# EAGLE design untitled (EAGLE 9.6.2)
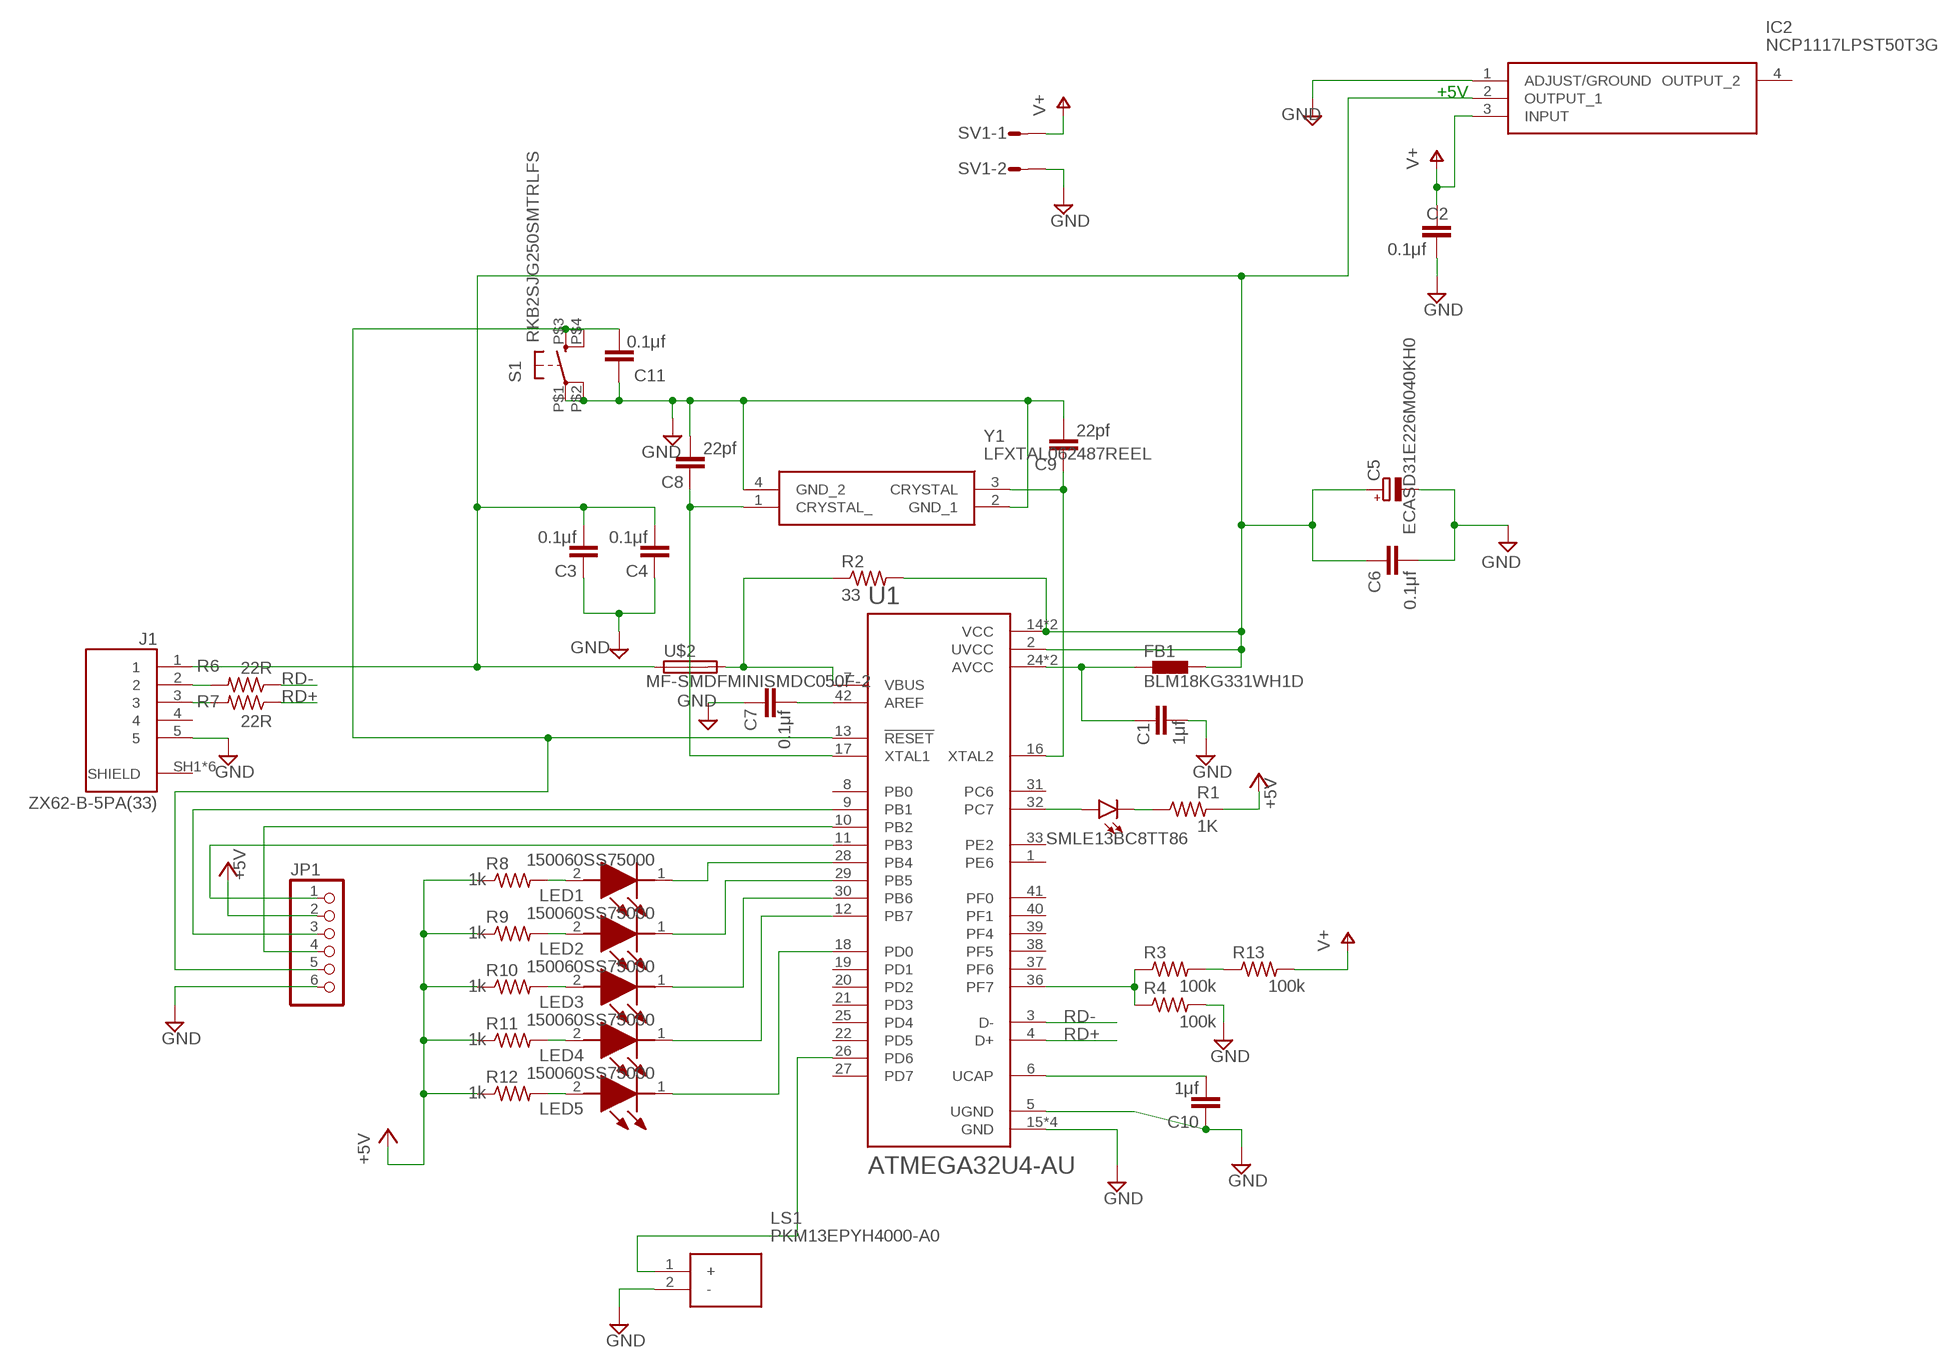
[diagram p0: schematic, sheet 1]

## Parts
C1  1μf  C-EUC0603  [C0603]
C2  0.1μf  C-EUC0603  [C0603]
C3  0.1μf  C-EUC0603  [C0603]
C4  0.1μf  C-EUC0603  [C0603]
C5  ECASD31E226M040KH0  [ECASD31E226M040KH0]
C6  0.1μf  C-EUC0603  [C0603]
C7  0.1μf  C-EUC0603  [C0603]
C8  22pf  C-EUC0603  [C0603]
C9  22pf  C-EUC0603  [C0603]
C10  1μf  C-EUC0603  [C0603]
C11  0.1μf  C-EUC0603  [C0603]
FB1  BLM18KG331WH1D  [BEADC1608X75N]
IC2  NCP1117LPST50T3G  [SOT230P700X180-4N]
J1  ZX62-B-5PA(33)  [HRS_ZX62-B-5PA(33)]
JP1  PINHD-1X6  [1X06]
LD1  LEDCHIPLED_0603  [CHIPLED_0603]
LED1  150060SS75000  [LEDC1608X80N]
LED2  150060SS75000  [LEDC1608X80N]
LED3  150060SS75000  [LEDC1608X80N]
LED4  150060SS75000  [LEDC1608X80N]
LED5  150060SS75000  [LEDC1608X80N]
LS1  PKM13EPYH4000-A0  [PKM13EPYH4002-B0]
R1  1K  R-US_R0603  [R0603]
R2  33  R-US_R0603  [R0603]
R3  100k  R-US_R0603  [R0603]
R4  100k  R-US_R0603  [R0603]
R6  22R  R-US_R0603  [R0603]
R7  22R  R-US_R0603  [R0603]
R8  1k  R-US_R0603  [R0603]
R9  1k  R-US_R0603  [R0603]
R10  1k  R-US_R0603  [R0603]
R11  1k  R-US_R0603  [R0603]
R12  1k  R-US_R0603  [R0603]
R13  100k  R-US_R0603  [R0603]
S1  RKB2SJG250SMTRLFS  [RKB2SJG250SMTRLFS]
SV1  L02P  [L02P]
U1  ATMEGA32U4-AU  [QFP80P1200X1200X120-44N]
U$2  MF-SMDFMINISMDC050F-2  [MINISMDC050F-2]
Y1  LFXTAL062487REEL  [LFXTAL062487REEL]

## Nets
+5V [PWR]: JP1.2 R1.2 R8.1 R9.1 R10.1 R11.1 R12.1
GND [New Class]: C1.2 C2.2 C3.1 C4.1 C5.P$2(-) C6.1 C7.1 C8.2 C9.2 C10.1 C11.1 IC2.1(ADJUST/GROUND) J1.5 JP1.6 LS1.2(-) R4.2 S1.P$1(P) S1.P$2(P1) SV1.2 U1.5(UGND) U1.15(GND) U1.23(GND) U1.35(GND) U1.43(GND) Y1.2(GND_1) Y1.4(GND_2)
N$1 [New Class]: C7.2 U1.42(AREF)
N$2 [New Class]: C10.2 U1.6(UCAP)
N$3 [New Class]: C1.1 FB1.1 U1.24(AVCC) U1.44(AVCC)
N$4 [New Class]: LD1.A U1.32(PC7)
N$5 [New Class]: C8.1 U1.17(XTAL1) Y1.1(CRYSTAL_)
N$6 [New Class]: C9.1 U1.16(XTAL2) Y1.3(CRYSTAL)
N$7 [New Class]: LED5.1(K) U1.18(PD0)
N$8 [New Class]: C3.2 C4.2 C5.P$1(+) C6.2 FB1.2 IC2.2(OUTPUT_1) J1.1 R2.2 U1.2(UVCC) U1.14(VCC) U1.34(VCC) U$2.P$1
N$9 [New Class]: J1.2 R6.2
N$10 [New Class]: J1.3 R7.2
N$11 [New Class]: LD1.C R1.1
N$12 [New Class]: R3.1 R4.1 U1.36(PF7)
N$13: R3.2 R13.1
N$15 [New Class]: R2.1 U1.7(VBUS) U$2.P$2
N$16 [New Class]: JP1.1 U1.11(PB3)
N$17 [New Class]: JP1.3 U1.9(PB1)
N$18 [New Class]: JP1.4 U1.10(PB2)
N$19 [New Class]: LED4.1(K) U1.12(PB7)
N$20 [New Class]: LED3.1(K) U1.30(PB6)
N$21 [New Class]: C11.2 JP1.5 S1.P$3(S) S1.P$4(S1) U1.13(!RESET)
N$22 [New Class]: LED2.1(K) U1.29(PB5)
N$23 [New Class]: LED1.1(K) U1.28(PB4)
N$24 [New Class]: LED1.2(A) R8.2
N$30 [New Class]: LED2.2(A) R9.2
N$31 [New Class]: LED3.2(A) R10.2
N$32 [New Class]: LED4.2(A) R11.2
N$33 [New Class]: LED5.2(A) R12.2
N$40 [New Class]: LS1.1(+) U1.26(PD6)
RD+ [New Class]: R7.1 U1.4(D+)
RD- [New Class]: R6.1 U1.3(D-)
V+ [PWR]: C2.1 IC2.3(INPUT) R13.2 SV1.1
Unconnected: IC2.4(OUTPUT_2) J1.4 J1.SH1(SHIELD) J1.SH2(SHIELD) J1.SH3(SHIELD) J1.SH4(SHIELD) J1.SH5(SHIELD) J1.SH6(SHIELD) U1.1(PE6) U1.8(PB0) U1.19(PD1) U1.20(PD2) U1.21(PD3) U1.22(PD5) U1.25(PD4) U1.27(PD7) U1.31(PC6) U1.33(PE2) U1.37(PF6) U1.38(PF5) U1.39(PF4) U1.40(PF1) U1.41(PF0)

## Notes on the sheet
- +5V
- SMLE13BC8TT86

## Library data of the parts
C1-C4 C6-C11 = rcl:C-EU: CAPACITOR, European symbol; SPICEPREFIX: C
C5 = ECASD31E226M040KH02:ECASD31E226M040KH0
FB1 = BEADC1608X75N:BLM18KG331WH1D: 100 Ohms @ 100MHz 1 Power Line Ferrite Bead 0603 (1608 Metric) 1.5A 55mOhm Check prices <https://pricing.snapeda.com/parts/BLM18KG331WH1D/Murata/view-part?ref=eda>; AVAILABILITY: In Stock; DESCRIPTION: 330 Ohms @ 100MHz 1 Power Line Ferrite Bead 0603 (1608 Metric) 1.25A 110mOhm; MF: Murata; MP: BLM18KG331WH1D; PACKAGE: 0603 Murata; PRICE: None; PURCHASE-URL: https://pricing.snapeda.com/search/part/BLM18KG331WH1D/?ref=eda
IC2 = SamacSys_Parts:NCP1117LPST50T3G: ON SEMICONDUCTOR - NCP1117LPST50T3G - LDO Voltage Regulator, Fixed, AEC-Q100, 18V input, 1.3 V drop., 1A out, SOT-223-3 Source: Datasheet <http://www.onsemi.com/pub/Collateral/NCP1117LP-D.PDF>; DESCRIPTION: ON SEMICONDUCTOR - NCP1117LPST50T3G - LDO Voltage Regulator, Fixed, AEC-Q100, 18V input, 1.3 V drop., 1A out, SOT-223-3; HEIGHT: 1.8mm; MANUFACTURER_NAME: ON Semiconductor; MANUFACTURER_PART_NUMBER: NCP1117LPST50T3G; MOUSER_PART_NUMBER: 863-NCP1117LPST50T3G; MOUSER_PRICE-STOCK: https://www.mouser.co.uk/ProductDetail/onsemi/NCP1117LPST50T3G?qs=kbSN2QblFfKscBRGjva23w%3D%3D
J1 = ZX62-B-5PA_33_:ZX62-B-5PA(33): ZX Series 5 Position Right Angle PCB Wire Micro B USB Plug Check prices <https://pricing.snapeda.com/parts/ZX62-B-5PA%2833%29/Hirose/view-part?ref=eda>; AVAILABILITY: In Stock; DESCRIPTION: USB - micro B USB 2.0 Receptacle Connector 5 Position Surface Mount, Right Angle; MF: Hirose; MP: ZX62-B-5PA(33); PACKAGE: None; PRICE: None; PURCHASE-URL: https://pricing.snapeda.com/search/part/ZX62-B-5PA(33)/?ref=eda
JP1 = pinhead:PINHD-1X6: PIN HEADER
LD1 = led:LED: LED OSRAM: - CHIPLED LG R971, LG N971, LY N971, LG Q971, LY Q971, LO R971, LY R971 LH N974, LH R974 LS Q976, LO Q976, LY Q976 LO Q996 - Hyper CHIPLED LW Q18S LB Q993, LB Q99A, LB R99A - SideLED LS A670, LO A670, LY A670, LG A670, LP A670 LB A673, LV A673, LT A673, LW A673 LH A674 LY A675 LS A676, LA A676, LO A676, LY A676, LW A676 LS A679, LY A679, LG A679 - Hyper Micro SIDELED® LS Y876, LA Y876, LO Y876, LY Y876 LT Y87S - SmartLED LW L88C, LW L88S LB L89C, LB L89S, LG L890 LS L89K, LO L89K, LY L89K LS L896, LA L896, LO L896, LY L896 - TOPLED LS T670, LO T670, LY T670, LG T670, LP T670 LSG T670, LSP T670, LSY T670, LOP T670, LYG T670 LG T671, LOG T671, LSG T671 LB T673, LV T673, LT T673, LW T673 LH T674 LS T676, LA T676, LO T676, LY T676, LB T676, LH T676, LSB T676, LW T676 LB T67C, LV T67C, LT T67C, LS T67K, LO T67K, LY T67K, LW E67C LS E67B, LA E67B, LO E67B, LY E67B, LB E67C, LV E67C, LT E67C LW T67C LS T679, LY T679, LG T679 LS T770, LO T770, LY T770, LG T770, LP T770 LB T773, LV T773, LT T773, LW T773 LH T774 LS E675, LA E675, LY E675, LS T675 LS T776, LA T776, LO T776, LY T776, LB T776 LHGB T686 LT T68C, LB T68C - Hyper Mini TOPLED® LB M676 - Mini TOPLED Santana® LG M470 LS M47K, LO M47K, LY M47K Source: http://www.osram.convergy.de LUXEON: - LUMILED® LXK2-PW12-R00, LXK2-PW12-S00, LXK2-PW14-U00, LXK2-PW14-V00 LXK2-PM12-R00, LXK2-PM12-S00, LXK2-PM14-U00 LXK2-PE12-Q00, LXK2-PE12-R00, LXK2-PE12-S00, LXK2-PE14-T00, LXK2-PE14-U00 LXK2-PB12-K00, LXK2-PB12-L00, LXK2-PB12-M00, LXK2-PB14-N00, LXK2-PB14-P00, LXK2-PB14-Q00 LXK2-PR12-L00, LXK2-PR12-M00, LXK2-PR14-Q00, LXK2-PR14-R00 LXK2-PD12-Q00, LXK2-PD12-R00, LXK2-PD12-S00 LXK2-PH12-R00, LXK2-PH12-S00 LXK2-PL12-P00, LXK2-PL12-Q00, LXK2-PL12-R00 Source: www.luxeon.com KINGBRIGHT: KA-3528ASYC Source: www.kingbright.com
LED1-LED5 = SamacSys_Parts:150060SS75000: LED,Wurth Elektronik,150060SS75000 Wurth Elektronik 150060SS75000, WL-SMCW Series Red LED, 630 nm, 1608 (0603) Clear, Rectangle Lens SMD Package Source: Datasheet; DESCRIPTION: LED,Wurth Elektronik,150060SS75000 Wurth Elektronik 150060SS75000, WL-SMCW Series Red LED, 630 nm, 1608 (0603) Clear, Rectangle Lens SMD Package; HEIGHT: 0.8mm; MANUFACTURER_NAME: Wurth Elektronik; MANUFACTURER_PART_NUMBER: 150060SS75000; MOUSER_PART_NUMBER: 710-150060SS75000; MOUSER_PRICE-STOCK: https://www.mouser.co.uk/ProductDetail/Wurth-Elektronik/150060SS75000?qs=LlUlMxKIyB0oQaxwspeTEA%3D%3D
LS1 = SamacSys_Parts:PKM13EPYH4000-A0: Transducer piezo PCB 30Vpp 70dB Murata 70dB Through Hole Continuous External Piezo Buzzer Source: Datasheet <http://www.murata.com/en-eu/api/pdfdownloadapi?cate=&partno=PKM13EPYH4000-A0>; DESCRIPTION: Transducer piezo PCB 30Vpp 70dB Murata 70dB Through Hole Continuous External Piezo Buzzer; HEIGHT: mm; MANUFACTURER_NAME: Murata Electronics; MANUFACTURER_PART_NUMBER: PKM13EPYH4000-A0; MOUSER_PART_NUMBER: 81-PKM13EPYH4000-A0; MOUSER_PRICE-STOCK: https://www.mouser.co.uk/ProductDetail/Murata-Electronics/PKM13EPYH4000-A0?qs=flZjIlU0hx3F33gxKU9zcw%3D%3D
R1-R4 R6-R13 = rcl:R-US_: RESISTOR, American symbol; SPICEPREFIX: R
S1 = RKB2SJG250SMTR LFS:RKB2SJG250SMTRLFS
SV1 = con-amp-mt:L02P: AMP MT CONNECTOR; OC_FARNELL: unknown; OC_NEWARK: unknown
U1 = ATMEGA32U4-AU:ATMEGA32U4-AU: ATmega Series 16 MHz 32 KB Flash 2.5 KB SRAM 8-Bit Microcontroller - TQFP-44 Check prices <https://pricing.snapeda.com/parts/ATMEGA32U4-AU/Microchip%20Technology/view-part?ref=eda>; AVAILABILITY: In Stock; DESCRIPTION: AVR AVR® ATmega Microcontroller IC 8-Bit 16MHz 32KB (16K x 16) FLASH 44-TQFP (10x10); MF: Microchip Technology; MP: ATMEGA32U4-AU; PACKAGE: TQFP-44 Microchip Technology / Atmel; PRICE: None; PURCHASE-URL: https://pricing.snapeda.com/search/part/ATMEGA32U4-AU/?ref=eda
U$2 = MINISMDC050F-2:MF-SMDF: MF-SMDF Series - PRC Resettable Fuses Source: http://www.farnell.com/datasheets/716597.pdf
Y1 = SamacSys_Parts:LFXTAL062487REEL: Crystals 16MHz 22pF -10C 60C Source: Datasheet <https://www.iqdfrequencyproducts.com/products/pn/LFXTAL062487Reel.pdf>; DESCRIPTION: Crystals 16MHz 22pF -10C 60C; HEIGHT: 0.6mm; MANUFACTURER_NAME: IQD; MANUFACTURER_PART_NUMBER: LFXTAL062487Reel; MOUSER_PART_NUMBER: 449-LFXTAL062487REEL; MOUSER_PRICE-STOCK: https://www.mouser.co.uk/ProductDetail/IQD/LFXTAL062487Reel?qs=e4%2FAndAAwgKTrG0QMc3CnQ%3D%3D

## Net classes
1 New Class: width 0.25 mm
2 PWR: width 1 mm

## Board
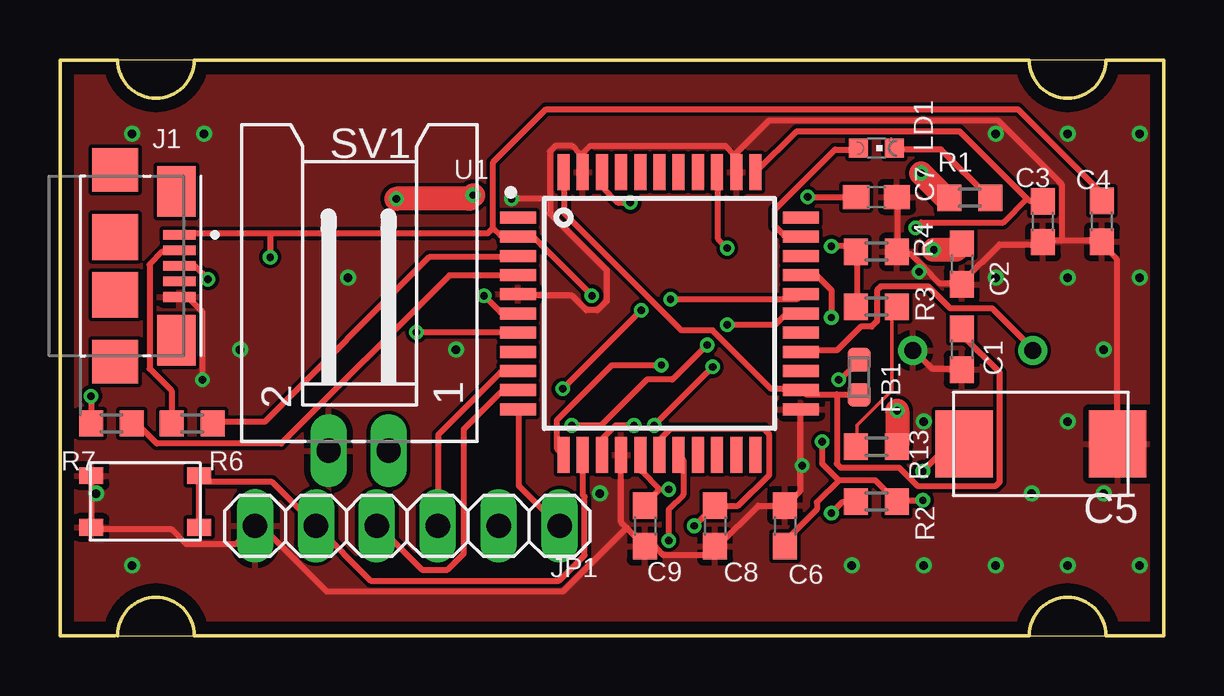
[diagram p1: board, top side]
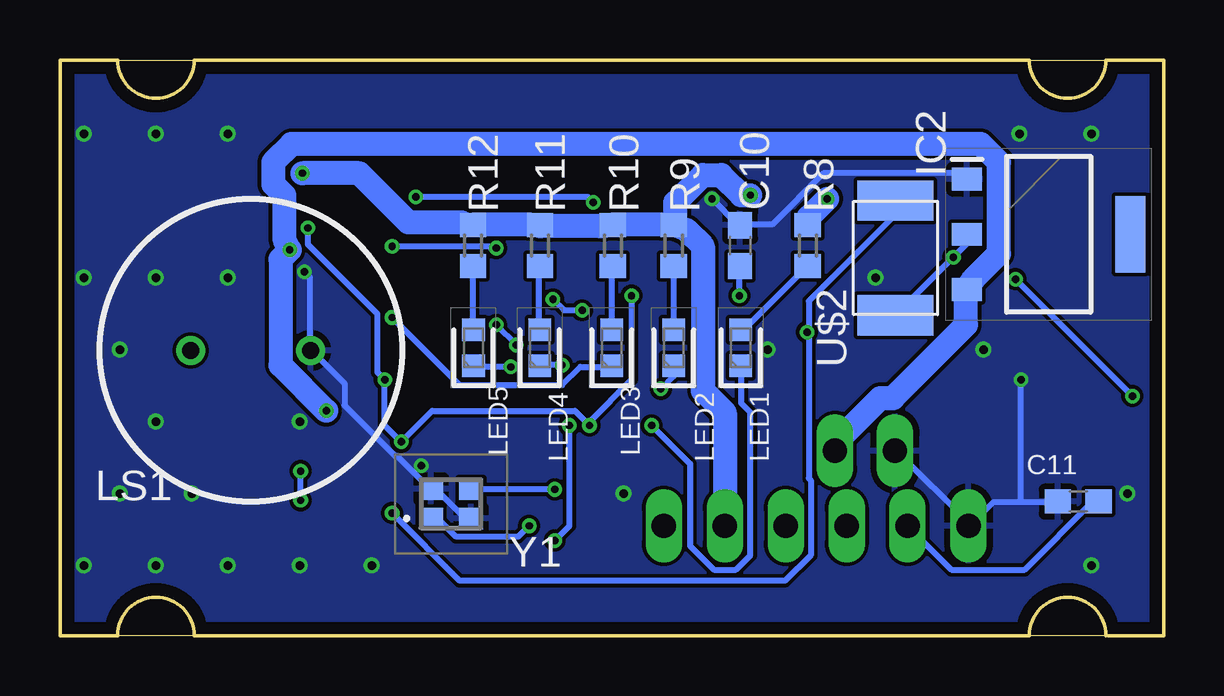
[diagram p2: board, bottom side, seen from below]

Size 46 x 24 mm. Coordinates in mm from the lower left corner, seen from the top.
Outline: 2.4,0 2.3,0 0,0 0,24 2.4,24
Outline: 2.4,0 5.6,0
Outline: 40.4,0 43.6,0
Outline: 43.6,24 40.4,24
Outline: 5.6,24 2.4,24
Outline: 2.4,0 arc-180 5.6,0
Outline: 40.4,0 arc-180 43.6,0
Outline: 43.6,24 arc-180 40.4,24
Outline: 5.6,24 arc-180 2.4,24
Outline: 5.6,24 40.4,24
Outline: 43.6,24 46,24 46,0 43.6,0
Outline: 40.4,0 5.6,0
Copper layers (1*16): Top 0.035mm / dielectric 1.6mm / Bottom 0.035mm
Design rules "Elecrow_2-layer_PCB_eagle_rule": minimum track width 6mil, minimum drill 12mil, track to track 6mil, track to pad 6mil, pad to pad 6mil, via to via 8mil, smd to smd 0mil, copper to edge 20mil, drill to drill 10mil, minimum pad ring 6mil, minimum via ring 6mil, stop-mask expansion 0mil, vias tented up to drill 100mil, thermal gap 10mil

### Footprints (pad centres in the part's own frame; a part is rotated, then mirrored left to right if it is on the bottom)
C0603 = smd 1.1 x 1: 1 -0.85,0; 2 0.85,0
ECASD31E226M040KH0 = smd 2.4 x 2.8: P$1 -3.2,0; P$2 3.2,0
BEADC1608X75N = smd 1 x 0.97: 1 -0.735,0; 2 0.735,0
SOT230P700X180-4N = smd 1.25 x 0.95: 1 -3.4,2.3; 2 -3.4,0; 3 -3.4,-2.3 | smd 1.25 x 3.2: 4 3.4,0
HRS_ZX62-B-5PA(33) = smd 0.4 x 1.35: 1 -1.3,2.675; 2 -0.65,2.675; 3 0,2.675; 4 0.65,2.675; 5 1.3,2.675 | smd 2.1 x 1.6: SH1 -3.1,2.55; SH6 3.1,2.55 | smd 1.8 x 1.9: SH2 -4,0; SH5 4,0 | smd 1.9 x 1.9: SH3 -1.2,0; SH4 1.2,0
1X06 = drill 1.016 long: 1 -6.35,0; 2 -3.81,0; 3 -1.27,0; 4 1.27,0; 5 3.81,0; 6 6.35,0
CHIPLED_0603 = smd 0.8 x 0.8: A 0,-0.75; C 0,0.75
LEDC1608X80N = smd 0.95 x 0.95: 1 -0.75,0; 2 0.75,0
PKM13EPYH4002-B0 = drill 0.7 pad 1.2: 1 -2.5,0; 2 2.5,0
R0603 = smd 1 x 1.1: 1 -0.85,0; 2 0.85,0
RKB2SJG250SMTRLFS = smd 1 x 0.7: P$1 -2.25,1.075; P$2 -2.25,-1.075; P$3 2.25,-1.075; P$4 2.25,1.075
L02P = drill 1.016 long: 1 1.25,-6.25; 2 -1.25,-6.25
QFP80P1200X1200X120-44N = smd 1.5 x 0.5: 1 -5.9,4; 2 -5.9,3.2; 3 -5.9,2.4; 4 -5.9,1.6; 5 -5.9,0.8; 6 -5.9,0; 7 -5.9,-0.8; 8 -5.9,-1.6; 9 -5.9,-2.4; 10 -5.9,-3.2; 11 -5.9,-4; 23 5.9,-4; 24 5.9,-3.2; 25 5.9,-2.4; 26 5.9,-1.6; 27 5.9,-0.8; 28 5.9,0; 29 5.9,0.8; 30 5.9,1.6; 31 5.9,2.4; 32 5.9,3.2; 33 5.9,4 | smd 0.5 x 1.5: 12 -4,-5.9; 13 -3.2,-5.9; 14 -2.4,-5.9; 15 -1.6,-5.9; 16 -0.8,-5.9; 17 0,-5.9; 18 0.8,-5.9; 19 1.6,-5.9; 20 2.4,-5.9; 21 3.2,-5.9; 22 4,-5.9; 34 4,5.9; 35 3.2,5.9; 36 2.4,5.9; 37 1.6,5.9; 38 0.8,5.9; 39 0,5.9; 40 -0.8,5.9; 41 -1.6,5.9; 42 -2.4,5.9; 43 -3.2,5.9; 44 -4,5.9
MINISMDC050F-2 = smd 1.68 x 3.15: P$1 -2.39,0; P$2 2.39,0
LFXTAL062487REEL = smd 1 x 0.9: 1 -0.825,-0.613; 2 0.825,-0.613; 3 0.825,0.613; 4 -0.825,0.613

### Placement (x,y rotation side)
C1  37.59,11.94 270 top
C2  37.59,15.49 270 top
C3  40.97,17.26 90 top
C4  43.43,17.27 90 top
C5  40.89,7.99 0 top
C6  30.23,4.57 270 top
C7  34.04,18.29 180 top
C8  27.3,4.57 270 top
C9  24.38,4.57 270 top
C10  17.65,16.26 270 bottom
C11  3.56,5.59 0 bottom
FB1  33.31,10.76 90 top
IC2  4.79,16.73 0 bottom
J1  2.3,15.41 270 top
JP1  14.48,4.57 180 top
LD1  34.04,20.32 270 top
LED1  17.62,12 90 bottom
LED2  20.42,12 90 bottom
LED3  23,12 90 bottom
LED4  26,12 90 bottom
LED5  28.77,12 90 bottom
LS1  38.05,11.89 0 bottom
R1  37.93,18.26 180 top
R2  34.04,5.59 0 top
R3  34.04,13.72 0 top
R4  34.04,16 0 top
R6  5.51,8.84 180 top
R7  2.14,8.84 180 top
R8  14.83,16.26 270 bottom
R9  20.42,16.26 270 bottom
R10  22.96,16.26 270 bottom
R11  25.99,16.26 270 bottom
R12  28.78,16.26 270 bottom
R13  34.04,7.87 0 top
S1  3.56,5.59 0 top
SV1  12.45,13.95 0 top
U1  24.99,13.43 0 top
U$2  11.18,15.75 90 bottom
Y1  29.7,5.49 0 bottom

### Tracks (layer width: path | path; a pad name or v marks a point on that pad's centre or on a via)
+5V  (via drill 0.3)
  Top 1: v14.02,18.21 17.07,18.21 v17.22,18.36 | v35.89,19.28 36.88,18.29 37.03,18.29 R1.2
  Bottom 1: v14.02,18.21 14.78,17.45 14.78,17.14 R8.1 | v17.22,18.36 17.6,18.36 18.44,19.2 19.2,19.2 20.34,18.06 20.34,17.14 R9.1 | R9.1 20.88,17.14 22.94,17.14 R10.1 23.47,17.07 25.98,17.07 R11.1 26.44,17.14 28.73,17.14 R12.1 29.26,17.22 31.47,17.22 33.53,19.28 v35.89,19.28 | JP1.2 18.29,9.3 19.2,10.21 19.2,16.23 19.89,16.92 R9.1
GND  (via drill 0.3, 0.35)
  Top 0.25: S1.P$1 1.29,6.63 1.29,4.57 S1.P$2 1.37,4.42 4.65,4.42 5.26,3.81 7.32,3.81 8.08,4.57 JP1.6 8.38,4.57 11.12,1.83 20.95,1.83 23.62,4.5 | v5.94,10.67 5.94,13.49 5.33,14.1 5.03,14.1 J1.5 | 23.62,4.5 24.31,3.81 C9.2 24.38,3.66 24.84,3.66 25.15,3.35 26.98,3.35 27.28,3.66 C8.2 27.43,3.73 29.11,5.41 30.18,5.41 C6.1 30.33,5.49 30.86,6.02 30.86,7.09 | 23.62,4.5 23.39,4.72 23.39,7.47 U1.15 | 30.86,7.09 30.86,9.37 U1.23 | C1.2 37.57,11.12 36.35,11.12 35.59,11.89 LS1.2 | v30.94,7.09 30.86,7.09 | 41.76,16.46 43.43,16.46 C4.1 43.43,16.31 44.04,15.7 44.04,8 C5.P$2 | 41.76,16.46 41,16.46 C3.1 40.92,16.31 39.17,16.31 37.64,14.78 C2.2 37.57,14.71 36.65,14.71 36.01,15.35 | C7.1 R4.2 34.98,15.93 35.43,15.93 36.01,15.35 | 20.42,18.21 20.42,20.19 20.65,20.42 21.34,20.42 21.72,20.04 | 20.42,18.21 20.42,17.6 22.78,15.24 22.78,13.95 22.4,13.56 21.95,13.56 21.34,14.17 19.13,14.17 U1.5 | 21.72,20.04 21.72,19.36 U1.43 | 28.12,20.04 28.12,19.36 U1.35 | 28.12,20.04 27.74,20.42 22.1,20.42 21.72,20.04 | 20.42,18.21 v18.82,18.21 | 41.76,16.46 41.76,18.82 39.09,21.49 29.57,21.49 28.12,20.04 | 36.01,15.35 v35.81,15.16
  Bottom 0.25: 5.94,5.56 7.09,5.56 8.08,4.57 JP1.6 8.08,4.65 11.12,7.7 SV1.2 | 5.94,5.56 4.42,5.56 C11.1 | 5.94,5.56 v5.94,10.67 | Y1.2 28.88,4.95 29.18,4.95 30.33,6.1 30.48,6.1 Y1.4 30.63,6.17 31.24,6.78 | 31.24,6.78 31.93,7.47 32,7.47 34.14,9.6 34.14,10.52 35.51,11.89 LS1.2 35.59,11.96 35.59,14.94 v35.81,15.16 | 31.24,6.78 v30.94,7.09 | IC2.1 8.23,19.05 8.46,19.28 14.17,19.28 16.31,17.14 17.6,17.14 C10.1 17.75,17.14 v18.82,18.21
  other vias: 3.01,2.92 1.51,5.92 3.01,20.92 6.01,20.92 7.51,11.92 12.01,14.92 16.51,11.92 22.51,5.92 33.01,2.92 36.01,2.92 36.01,8.92 39.01,2.92 39.01,14.92 39.01,20.92 42.01,2.92 40.51,5.92 42.01,8.92 42.01,14.92 42.01,20.92 45.01,2.92 43.51,5.92 43.51,11.92 45.01,14.92 45.01,20.92
  pour Top: 0,24 0,0 46,0 46,24
  pour Bottom: 0,24 0,0 46,0 46,24
N$1  (via drill 0.3)
  Top 0.25: v31.17,18.29 C7.2 | v23.77,18.06 23.24,18.06 22.63,18.67 22.63,19.28 U1.42
  Bottom 0.25: v31.17,18.29 24,18.29 v23.77,18.06
N$2  (via drill 0.3)
  Top 0.25: v17.68,14.17 18.36,13.49 19.05,13.49 U1.6
  Bottom 0.25: v17.68,14.17 17.68,15.39 C10.2
N$3
  Top 0.25: 32.38,10.06 31.09,10.06 30.94,10.21 U1.24 30.79,10.29 29.64,10.29 27.2,12.72 25.91,12.72 21.03,17.6 21.03,19.28 U1.44 | 32.38,10.06 33.3,10.06 FB1.1 | 32.38,10.06 32.38,7.16 32.54,7.01 34.98,7.01 35.74,6.25 39.01,6.25 39.17,6.4 39.17,10.97 37.64,12.5 37.64,12.72 C1.1
N$4
  Top 0.25: LD1.A 33.22,20.27 32.31,20.27 29.79,17.75 29.79,17.07 30.18,16.69 30.86,16.69 U1.32
N$5  (via drill 0.3)
  Top 0.25: v26.44,4.57 27.28,5.41 C8.1 27.43,5.41 28.27,5.41 29.57,6.71 29.57,8.38 29.34,8.61 25.45,8.61 24.99,8.15 24.99,7.54 U1.17
  Bottom 0.25: v26.44,4.57 26.9,4.12 29.49,4.12 30.25,4.88 30.48,4.88 Y1.1
N$6  (via drill 0.3)
  Top 0.25: 24.99,6.1 v25.38,6.1 | 24.99,6.1 24.38,5.49 C9.1 | 24.99,6.1 24.23,6.86 24.23,7.47 U1.16
  Bottom 0.25: v25.38,6.1 28.8,6.1 Y1.3
N$7  (via drill 0.3)
  Top 0.25: v24.77,8.76 v27.2,11.2 | v25.38,3.96 25.38,5.26 25.98,5.87 25.98,7.32 25.83,7.47 U1.18
  Bottom 0.25: v27.2,11.2 28.73,11.2 LED5.1 | v24.77,8.76 24.77,4.57 v25.38,3.96
N$8  (via drill 0.3)
  Top 0.25: 40.31,18.21 37.49,21.03 30.71,21.03 29.03,19.36 U1.34 | 40.31,18.21 40.39,18.14 40.92,18.14 C3.2 | v32.46,10.67 32.54,10.67 33.3,11.43 FB1.2 | v31.77,8.08 31.77,7.16 32.46,6.48 | 32.46,6.48 33.98,6.48 34.82,5.64 R2.2 34.98,5.64 v35.97,5.64 | 32.46,6.48 31.55,5.56 31.55,5.26 30.25,3.96 30.25,3.73 C6.2 | v23.93,8.76 23.16,8.76 22.63,8.23 22.63,7.54 U1.14 | v35.97,6.86 37.03,7.92 37.64,7.92 C5.P$1 | 40.31,18.21 39.32,17.22 35.89,17.22 v35.66,16.99 | C4.2 43.43,18.44 39.93,21.95 20.27,21.95 18.06,19.74 18.06,16.99 | 18.06,16.99 18.36,16.69 19.05,16.69 U1.2 19.2,16.61 19.74,16.61 v22.17,14.17 | 8.76,16.76 17.83,16.76 18.06,16.99 | 8.76,16.76 5.03,16.76 J1.1 | 8.76,16.76 v8.76,15.77
  Bottom 0.25: v35.97,5.64 v35.97,6.86 | v35.66,16.99 35.66,16.31 32.77,13.41 32.77,10.97 v32.46,10.67 32.46,8.76 v31.77,8.08 30.48,9.37 24.54,9.37 v23.93,8.76 23.93,8.91 22.17,10.67 v22.17,14.17 | IC2.2 8.23,16.69 8.23,16.31 v8.76,15.77 11.12,13.41 U$2.P$1
N$9
  Top 0.25: R6.2 4.65,8.91 4.65,10.21 3.73,11.12 3.73,15.47 4.27,16 4.95,16 J1.2
N$10  (via drill 0.3)
  Top 0.25: v1.29,9.98 1.29,8.91 R7.2 | v6.17,14.86 5.64,15.39 5.03,15.39 J1.3
  Bottom 0.25: v6.17,14.86 v1.29,9.98
N$11
  Top 0.25: LD1.C 34.82,20.27 36.73,20.27 38.71,18.29 R1.1
N$12  (via drill 0.3)
  Top 0.25: R3.1 33.22,13.72 33.22,16 R4.1 33.07,16 32.84,16.23 v32.16,16.23 | v27.81,16.15 27.43,16.54 27.43,19.28 U1.36
  Bottom 0.25: v27.81,16.15 28.04,16.15 28.12,16.23 v32.16,16.23
N$13
  Top 0.152: R13.1 33.22,7.92 33.22,8.76 34.67,10.21 34.67,13.56 34.82,13.72 R3.2
N$15  (via drill 0.3)
  Top 0.25: v32.16,5.11 32.61,5.56 33.15,5.56 R2.1 | v14.86,12.65 19.05,12.65 U1.7
  Bottom 0.25: v32.16,5.11 29.34,2.29 15.77,2.29 14.71,3.35 14.71,6.48 14.78,6.55 14.78,12.65 | 14.78,12.65 14.78,13.95 11.2,17.53 11.2,18.14 U$2.P$2 | v14.86,12.65 14.78,12.65
N$16
  Top 0.25: U1.11 19.13,9.37 19.13,6.25 20.8,4.57 JP1.1
N$17
  Top 0.25: U1.9 19.05,10.97 18.36,10.97 15.77,8.38 15.77,4.57 JP1.3
N$18
  Top 0.25: U1.10 19.05,10.21 18.44,10.21 16.84,8.61 16.84,3.43 16.15,2.74 15.09,2.74 13.26,4.57 JP1.4
N$19  (via drill 0.3)
  Top 0.25: v25.07,11.28 23.01,11.28 20.73,8.99 20.73,7.77 20.95,7.54 U1.12
  Bottom 0.25: v25.07,11.28 25.98,11.28 LED4.1
N$20  (via drill 0.3)
  Top 0.25: v32.16,13.26 32.16,14.4 31.55,15.01 30.94,15.01 U1.30
  Bottom 0.25: v32.16,13.26 29.34,10.44 25.07,10.44 24.31,11.2 23.01,11.2 LED3.1
N$21
  Top 0.25: S1.P$3 5.79,4.57 5.79,6.63 S1.P$4 5.87,6.4 8.84,6.4 JP1.5 12.95,2.29 20.8,2.29 21.87,3.35 21.87,5.79 21.79,5.87 21.79,7.47 U1.13
  Bottom 0.25: JP1.5 8.84,2.74 5.79,2.74 2.97,5.56 2.74,5.56 C11.2
N$22  (via drill 0.3)
  Top 0.25: v24.23,13.56 v20.95,10.29 | v25.45,14.02 30.71,14.02 30.86,14.17 U1.29
  Bottom 0.25: v20.95,10.29 20.42,10.82 20.42,11.2 LED2.1 | v24.23,13.56 24.99,13.56 v25.45,14.02
N$23  (via drill 0.3)
  Top 0.25: v21.34,8.76 22.55,8.76 24.46,10.67 25.53,10.67 v26.98,12.12 | v27.81,12.95 29.79,12.95 30.25,13.41 30.86,13.41 U1.28
  Bottom 0.25: v21.34,8.76 19.74,7.16 19.74,3.73 18.75,2.74 17.83,2.74 17.22,3.35 17.22,9.3 17.6,9.68 17.6,11.2 LED1.1 | v27.81,12.95 v26.98,12.12
N$24
  Bottom 0.25: LED1.2 17.6,12.8 17.45,12.8 14.86,15.39 R8.2
N$30
  Bottom 0.25: LED2.2 20.42,12.8 20.42,15.39 R9.2
N$31
  Bottom 0.25: LED3.2 23.01,12.8 23.01,15.39 R10.2
N$32
  Bottom 0.25: LED4.2 26.06,12.8 26.06,15.39 R11.2
N$33
  Bottom 0.25: LED5.2 28.8,12.8 28.8,15.39 R12.2
N$40
  Top 0.25: U1.26 30.94,11.89 32.38,11.89 33.38,12.88 33.83,12.88 34.06,13.11 34.06,14.4 34.21,14.55 36.2,14.55 37.11,13.64 38.86,13.64 40.54,11.96 LS1.1
RD+
  Top 0.25: R7.1 3.05,8.84 3.2,8.84 4.04,8 9.22,8 16.23,15.01 19.05,15.01 U1.4
RD-
  Top 0.25: R6.1 6.4,8.91 8.53,8.91 15.39,15.77 19.05,15.77 U1.3
V+  (via drill 0.3)
  Top 1: v34.9,9.37 34.9,7.92 R13.2 | v36.42,16.08 37.34,16.08 37.57,16.31 C2.1
  Bottom 1: v34.9,9.37 36.8,11.28 36.8,15.7 v36.42,16.08 36.65,16.54 36.65,18.36 37.11,18.82 37.11,19.74 36.35,20.5 7.62,20.5 6.86,19.74 6.86,15.93 7.92,14.86 IC2.3 8.23,14.4 8.23,12.95 11.28,9.91 11.81,9.91 13.64,8.08 13.64,7.77 SV1.1